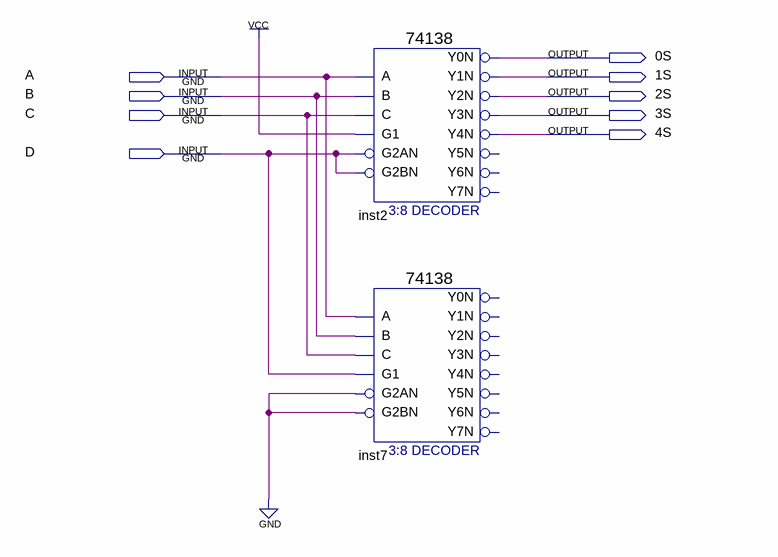
[diagram p0: schematic sheet]
// Quartus schematic Block6.bdf as structural Verilog: 2 symbols, 9 pins
module Block6 (
  input  A,
  input  B,
  input  C,
  input  D,
  output \0S ,
  output \1S ,
  output \2S ,
  output \3S ,
  output \4S 
);

  \74138  inst2 (
    .A(A), .B(B), .G1(1'b1), .C(C), .G2AN(D), .G2BN(D), .Y0N(\0S ), .Y1N(\1S ), .Y2N(\2S ), .Y3N(\3S ),
    .Y4N(\4S ));  // open: Y5N, Y6N, Y7N
  \74138  inst7 (
    .A(A), .B(B), .G1(D), .C(C), .G2AN(1'b0), .G2BN(1'b0));  // open: Y0N, Y1N, Y2N, Y3N, Y4N, Y5N, Y6N, Y7N
endmodule
